# EAGLE design BandpassedGainAmpSMT (EAGLE 9.6.2)
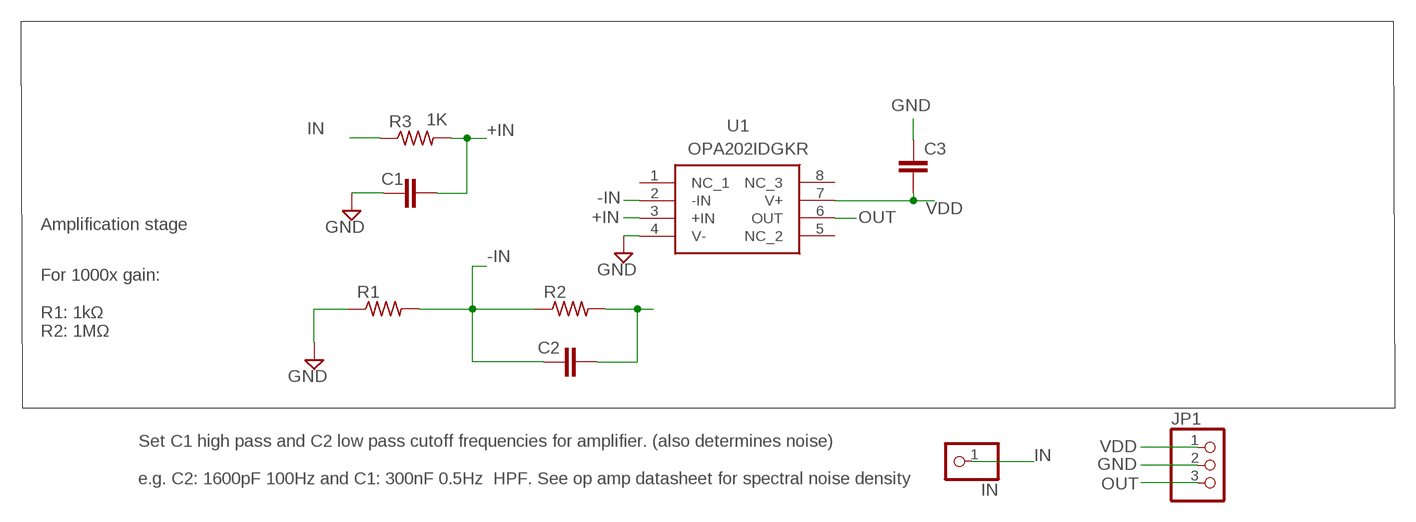
[diagram p0: schematic, sheet 1]

## Parts
C1  C-EUC0402  [C0402]
C2  C-EUC0402  [C0402]
C3  C-EUC0402  [C0402]
IN  PINHD-1X1  [1X01]
JP1  PINHD-1X3  [1X03]
R1  R-US_R0402  [R0402]
R2  R-US_R0402  [R0402]
R3  1K  R-US_R0402  [R0402]
U1  OPA202IDGKR  [SOP65P490X110-8N]

## Nets
+IN: C1.2 R3.2 U1.3(+IN)
-IN: C2.1 R1.2 R2.1 U1.2(-IN)
GND: C1.1 C3.1 JP1.2 R1.1 U1.4(V-)
IN: IN.1 R3.1
N$3: C2.2 R2.2
OUT: JP1.3 U1.6(OUT)
VDD: C3.2 JP1.1 U1.7(V+)
Unconnected: U1.1(NC_1) U1.5(NC_2) U1.8(NC_3)

## Notes on the sheet
- Amplification stage
- For 1000x gain:
  
  R1: 1kΩ
  R2: 1MΩ
- Set C1 high pass and C2 low pass cutoff frequencies for amplifier. (also determines noise)
  
  e.g. C2: 1600pF 100Hz and C1: 300nF 0.5Hz  HPF. See op amp datasheet for spectral noise density

## Library data of the parts
C1-C3 = rcl:C-EU: CAPACITOR, European symbol; SPICEPREFIX: C
IN = pinhead:PINHD-1X1: PIN HEADER
JP1 = pinhead:PINHD-1X3: PIN HEADER
R1-R3 = rcl:R-US_: RESISTOR, American symbol; SPICEPREFIX: R
U1 = OPA202IDGKR:OPA202IDGKR: Precision Amplifiers Low noise (0.2- uVPP, 9-nV/ Hz), heavy capacitive drive (25-nF), super beta, precision op amp 8-VSSOP -40 to 105 Source: Datasheet <https://www.ti.com/lit/ds/symlink/opa202.pdf?ts=1636402854008&ref_url=https%3A%2F%2Fwww.ti.com%2Fproduct%2FOPA202>; DESCRIPTION: Precision Amplifiers Low noise (0.2- uVPP, 9-nV/ Hz), heavy capacitive drive (25-nF), super beta, precision op amp 8-VSSOP -40 to 105; HEIGHT: 1.1mm; MANUFACTURER_NAME: Texas Instruments; MANUFACTURER_PART_NUMBER: OPA202IDGKR; MOUSER_PART_NUMBER: 595-OPA202IDGKR; MOUSER_PRICE-STOCK: https://www.mouser.co.uk/ProductDetail/Texas-Instruments/OPA202IDGKR?qs=7MVldsJ5UaxKAkmdzK%2FGCA%3D%3D

## Board
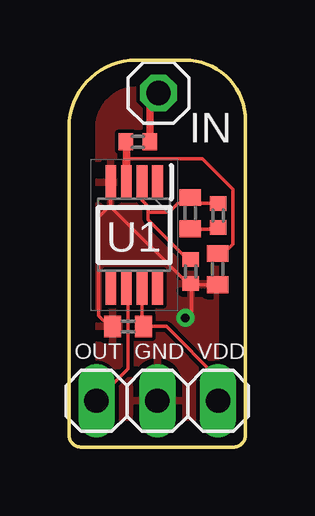
[diagram p1: board, top side]
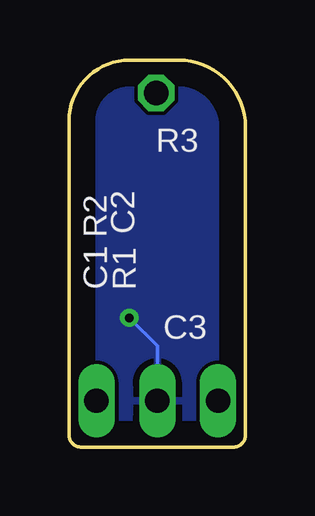
[diagram p2: board, bottom side, seen from below]

Size 7.37 x 16.13 mm. Coordinates in mm from the lower left corner, seen from the top.
Outline: 0,0.51 0,13.34 arc-90 2.79,16.13 4.83,16.13 arc-90 7.37,13.59 7.37,0.51 arc-90 6.86,0 0.51,0 arc-90 0,0.51
Copper layers (1*16): Top 0.035mm / dielectric 1.5mm / Bottom 0.035mm
Design rules "default": minimum track width 6mil, minimum drill 0.35mm, track to track 6mil, track to pad 6mil, pad to pad 6mil, via to via 6mil, smd to smd 6mil, copper to edge 40mil, drill to drill 6mil, minimum pad ring 10mil, minimum via ring 8mil, stop-mask expansion 4mil, vias tented up to drill 0mil, thermal gap 10mil

### Footprints (pad centres in the part's own frame; a part is rotated, then mirrored left to right if it is on the bottom)
C0402 = smd 0.7 x 0.9: 1 -0.65,0; 2 0.65,0
1X01 = drill 1.016 octagon: 1 0,0
1X03 = drill 1.016 long: 1 -2.54,0; 2 0,0; 3 2.54,0
R0402 = smd 0.6 x 0.7: 1 -0.5,0; 2 0.5,0
SOP65P490X110-8N = smd 1.4 x 0.45: 1 -2.2,0.975; 2 -2.2,0.325; 3 -2.2,-0.325; 4 -2.2,-0.975; 5 2.2,-0.975; 6 2.2,-0.325; 7 2.2,0.325; 8 2.2,0.975

### Placement (x,y rotation side)
C1  6.2,7.42 90 top
C2  5.05,9.75 270 top
C3  2.46,5.03 0 top
IN  3.73,14.76 0 top
JP1  3.68,1.93 180 top
R1  5.08,7.32 90 top
R2  6.22,9.65 270 top
R3  2.87,12.73 180 top
U1  2.72,8.84 270 top

### Tracks (layer width: path | path; a pad name or v marks a point on that pad's centre or on a via)
+IN
  Top 0.152: 2.39,11.94 2.47,12.02 5.56,12.02 6.83,10.74 6.83,8.45 6.45,8.07 C1.2
  Top 0.305: R3.2 2.39,12.7 U1.3 | 2.39,11.73 2.39,11.91 U1.3 | U1.3 2.39,11.94
-IN
  Top 0.152: U1.2 3.04,10.29 3.3,10.03 3.3,9.78 | 4.8,10.15 R2.1 5.97,10.15 | 3.3,9.78 4.17,9.78 4.55,10.15 4.8,10.15 | 4.88,10.4 C2.1 4.8,10.15 | R1.2 4.97,7.81 3.3,9.48 3.3,9.78
GND  (via drill 0.35)
  Top 0.152: 1.74,10.1 1.74,10.02 5.1,6.65 | 1.74,10.1 U1.4 | 1.74,10.1 1.23,9.59 1.23,5.48 1.69,5.03 C3.1 | v4.85,5.38 5.1,5.64 5.1,6.65 | 6.2,6.8 C1.1 5.13,6.77 5.1,6.79 | R1.1 5.1,6.79 | 5.1,6.79 5.1,6.65
  Bottom 0.152: v4.85,5.38 3.68,4.22 JP1.2
  pour Top: -0.76,-0.51 8.38,-0.51 8.38,16.89 -0.76,16.89
  pour Bottom: -0.64,-0.89 -0.64,16.76 8.51,16.76 8.51,-0.89
IN
  Top 0.305: R3.1 3.37,14.39 IN.1
N$3
  Top 0.152: 4.81,9.1 C2.2 5.09,9.07 5.87,9.07 5.95,9.15 R2.2
OUT
  Top 0.152: U1.6 2.47,6.56 2.47,3.26 JP1.3
VDD
  Top 0.152: U1.7 3.04,5.1 C3.2 4.06,5.03 6.22,2.87 JP1.1

### Text on the board
tNames: IN | OUT GND VDD